# EAGLE board tracker (EAGLE 9.6.2), part 1 of 3
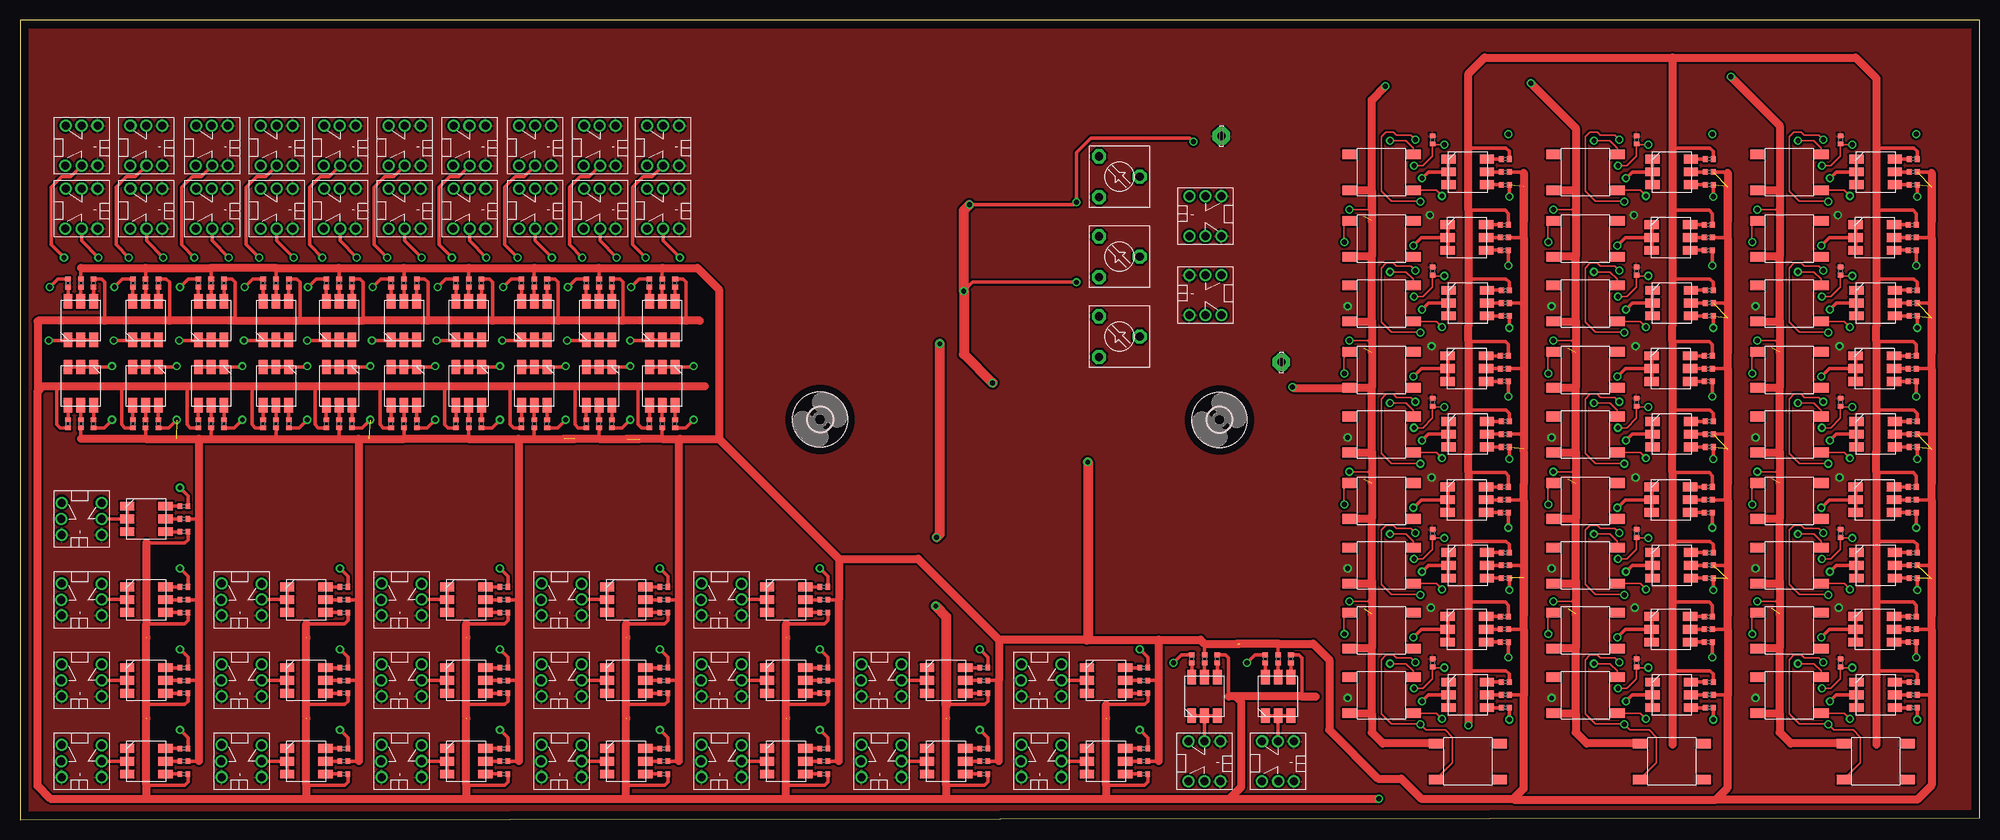
[diagram p6: board, top side]
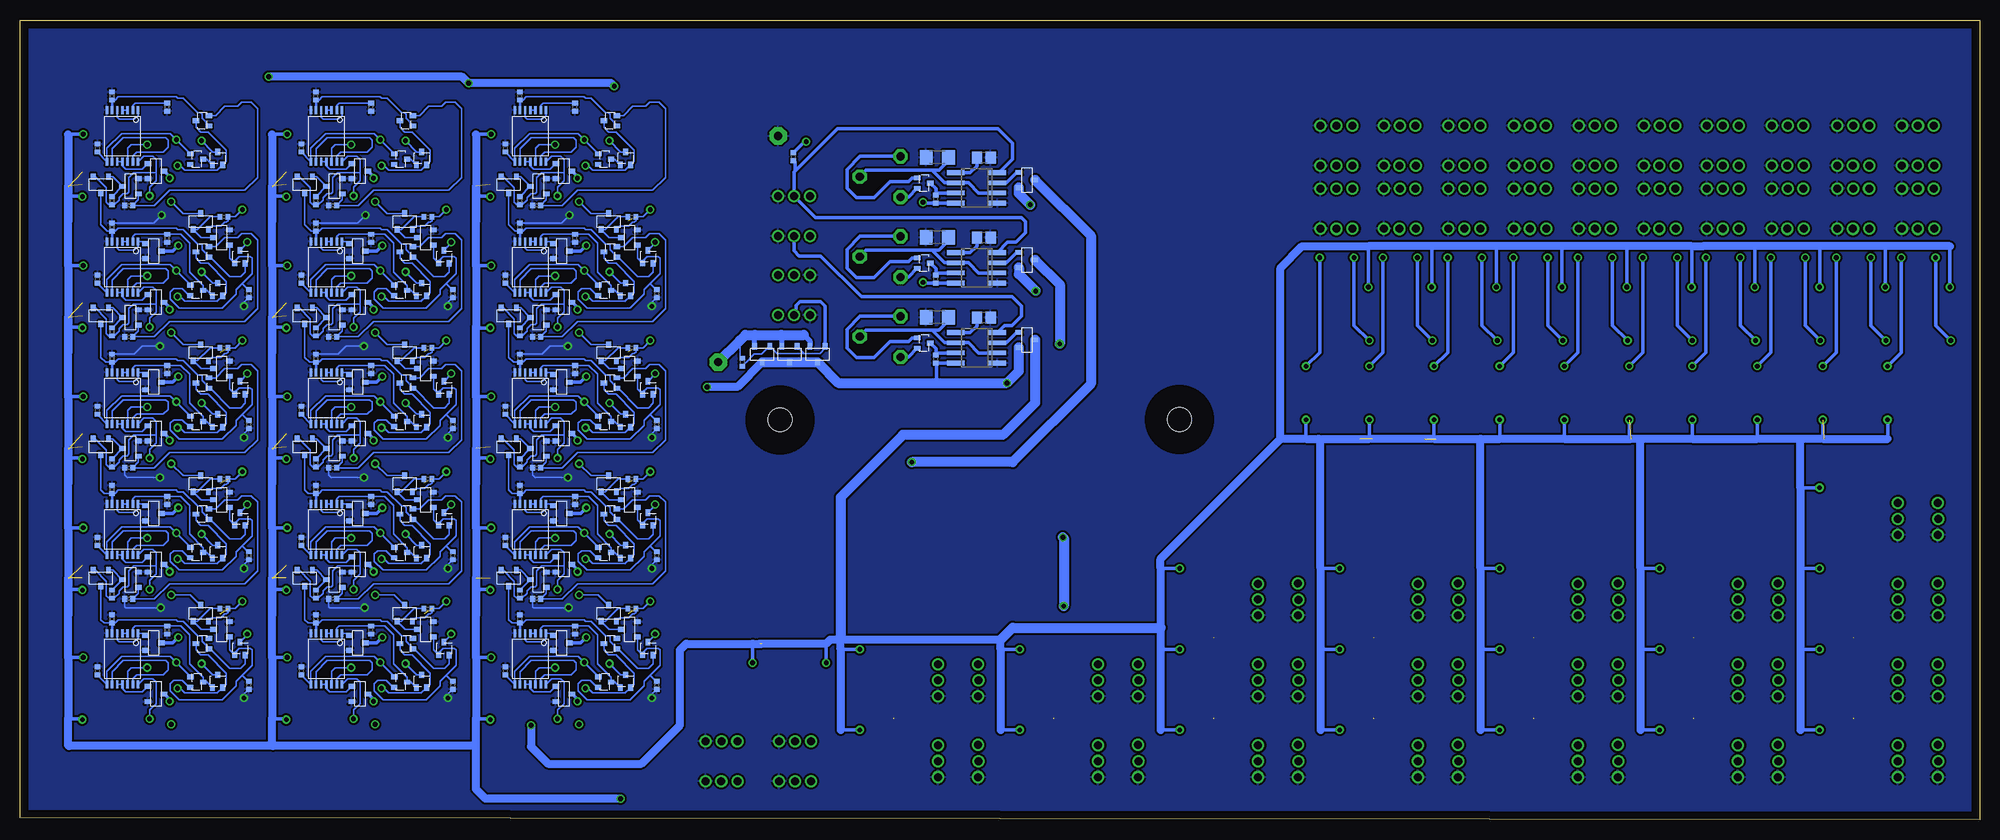
[diagram p7: board, bottom side, seen from below]

Size 245 x 100 mm. Coordinates in mm from the lower left corner, seen from the top.
Outline: 0,0 245,0.2 245,100 0,100 0,0
Copper layers (1*16): Top 0.035mm / dielectric 1.5mm / Bottom 0.035mm
Design rules "default": minimum track width 6mil, minimum drill 0.35mm, track to track 6mil, track to pad 6mil, pad to pad 6mil, via to via 6mil, smd to smd 6mil, copper to edge 40mil, drill to drill 6mil, minimum pad ring 10mil, minimum via ring 8mil, stop-mask expansion 4mil, vias tented up to drill 0mil, thermal gap 10mil

## Footprints (pad centres in the part's own frame; a part is rotated, then mirrored left to right if it is on the bottom)
LSP10 = drill 1.016 pad 2.159 octagon: MP 0,0
C2012 = smd 1.3 x 1.5: 1 -0.85,0; 2 0.85,0
C3216 = smd 1.6 x 1.8: 1 -1.4,0; 2 1.4,0
3,0 = hole 3: 0,0
SO08 = smd 0.6 x 2.2: 1 -1.905,-2.6; 2 -0.635,-2.6; 3 0.635,-2.6; 4 1.905,-2.6; 5 1.905,2.6; 6 0.635,2.6; 7 -0.635,2.6; 8 -1.905,2.6
R0402 = smd 0.6 x 0.7: 1 -0.5,0; 2 0.5,0
PT-10 = drill 1.016 pad 1.778 octagon: 1 -2.54,-5.08; 2 2.54,-5.08; 3 0,0
SOT23 = smd 0.6 x 0.8: SINGLE1 0,1.01; WIDEL -0.95,-1.01; WIDER 0.95,-1.01
TSSOP14 = smd 0.3 x 1: 1 -1.95,-3.2; 2 -1.3,-3.2; 3 -0.65,-3.2; 4 0,-3.2; 5 0.65,-3.2; 6 1.3,-3.2; 7 1.95,-3.2; 8 1.95,3.2; 9 1.3,3.2; 10 0.65,3.2; 11 0,3.2; 12 -0.65,3.2; 13 -1.3,3.2; 14 -1.95,3.2
SOT323 = smd 0.6 x 0.8: 1WIDEL -0.65,-0.8; 2WIDER 0.65,-0.816; 3SINGLE 0,0.8
SMD_MICROSWITCH = smd 1.8 x 1.2: 1 -4,2.25; 2 4,2.25; 3 -4,-2.25; 4 4,-2.25
BISTABLE_SWITCH = drill 1: A1 -1.991,2.498; A2 -0.013,2.521; A3 2.017,2.5; B1 -1.991,-2.5; B2 0.011,-2.5; B3 1.989,-2.492
SOT23@1 = smd 0.6 x 0.8: SINGLE1 0,1.01; WIDEL -0.95,-1.01; WIDER 0.95,-1.01
BIG_SMD_LED = smd 1.8 x 1.1: 1 -2.4,1.6; 2 -2.4,0; 3 -2.4,-1.6; 4 2.4,-1.6; 5 2.4,0; 6 2.4,1.6

## Placement (x,y rotation side)
BATERY-\  LSP10  [LSP10]  150.2,85.5 90 top
BATTERY+  LSP10  [LSP10]  157.7,57.2 90 top
C1  10n  [C2012]  124.5,82.8 0 bottom
C4  470p  [C3216]  130.3,82.8 180 bottom
C7  10n  [C2012]  124.5,72.8 0 bottom
C8  470p  [C3216]  130.3,72.8 180 bottom
C11  10n  [C2012]  124.5,62.8 0 bottom
C12  470p  [C3216]  130.3,62.8 180 bottom
H1  MOUNT-HOLE3.0  [3,0]  149.98,49.99 0 top
H2  MOUNT-HOLE3.0  [3,0]  100.05,50.05 0 top
IC2  NE555D  [SO08]  125.4,79 90 bottom
IC4  NE555D  [SO08]  125.4,69 90 bottom
IC6  NE555D  [SO08]  125.4,59 90 bottom
R1  1k5  [R0402]  211.1,23.8 180 top
R2  1k5  [R0402]  20.5,7.3 180 top
R3  1k  [R0402]  20.5,5.7 180 top
R4  1k  [R0402]  211.1,22.2 180 top
R5  1k  [R0402]  211.1,25.4 180 top
R6  1k5  [R0402]  211.2,15.6 180 top
R7  1k  [R0402]  211.2,14 180 top
R8  1k  [R0402]  211.2,17.2 180 top
R9  1k5  [R0402]  194,26.4 180 bottom
R10  1k5  [R0402]  202.1,19.6 90 top
R11  1k5  [R0402]  209.8,18.6 90 bottom
R12  1k5  [R0402]  208,25.1 90 bottom
R13  1k5  [R0402]  201.1,23.7 270 bottom
R14  1k5  [R0402]  190.9,16.8 90 bottom
R15  1k5  [R0402]  154.7,57.2 90 bottom
R16  1k5  [R0402]  148.3,82.9 90 bottom
R21  1k  [R0402]  20.5,8.9 180 top
R28  1k5  [R0402]  20.5,17.4 180 top
R29  1k  [R0402]  20.5,15.8 180 top
R30  1k  [R0402]  20.5,19 180 top
R31  1k5  [R0402]  20.5,27.5 180 top
R32  1k  [R0402]  20.5,25.9 180 top
R33  1k  [R0402]  20.5,29.1 180 top
R34  1k5  [R0402]  20.5,37.6 180 top
R35  1k  [R0402]  20.5,36 180 top
R36  1k  [R0402]  20.5,39.2 180 top
R37  1k5  [R0402]  211.1,40 180 top
R38  1k  [R0402]  211.1,38.4 180 top
R39  1k  [R0402]  211.1,41.6 180 top
R40  1k5  [R0402]  211.2,31.8 180 top
R41  1k  [R0402]  211.2,30.2 180 top
R42  1k  [R0402]  211.2,33.4 180 top
R57  1k5  [R0402]  208,28.2 90 bottom
R58  1k5  [R0402]  194,42.6 180 bottom
R59  1k5  [R0402]  202.1,35.8 90 top
R60  1k5  [R0402]  40.5,7.3 180 top
R61  1k  [R0402]  40.5,5.7 180 top
R62  1k  [R0402]  40.5,8.9 180 top
R63  1k5  [R0402]  40.5,17.4 180 top
R64  1k  [R0402]  40.5,15.8 180 top
R65  1k  [R0402]  40.5,19 180 top
R66  1k5  [R0402]  40.5,27.5 180 top
R67  1k  [R0402]  40.5,25.9 180 top
R68  1k  [R0402]  40.5,29.1 180 top
R69  1k5  [R0402]  209.8,34.8 90 bottom
R70  1k5  [R0402]  208,41.3 90 bottom
R85  1k5  [R0402]  201.1,39.9 270 bottom
R86  1k5  [R0402]  190.9,33 90 bottom
R87  1k5  [R0402]  205.9,27.6 0 bottom
R88  1k5  [R0402]  211.1,56.4 180 top
R89  1k  [R0402]  211.1,54.8 180 top
R90  1k  [R0402]  211.1,58 180 top
R91  1k5  [R0402]  211.2,48.2 180 top
R92  1k5  [R0402]  60.5,7.3 180 top
R93  1k  [R0402]  60.5,5.7 180 top
R94  1k  [R0402]  60.5,8.9 180 top
R95  1k5  [R0402]  60.5,17.4 180 top
R96  1k  [R0402]  60.5,15.8 180 top
R97  1k  [R0402]  60.5,19 180 top
R98  1k5  [R0402]  60.5,27.5 180 top
R113  1k  [R0402]  60.5,25.9 180 top
R114  1k  [R0402]  60.5,29.1 180 top
R115  1k  [R0402]  211.2,46.6 180 top
R116  1k  [R0402]  211.2,49.8 180 top
R117  1k5  [R0402]  208,44.6 90 bottom
R118  1k5  [R0402]  194,59 180 bottom
R119  1k5  [R0402]  202.1,52.2 90 top
R120  1k5  [R0402]  209.8,51.2 90 bottom
R121  1k5  [R0402]  208,57.7 90 bottom
R122  1k5  [R0402]  201.1,56.3 270 bottom
R123  1k5  [R0402]  190.9,49.4 90 bottom
R124  1k5  [R0402]  80.5,7.3 180 top
R125  1k  [R0402]  80.5,5.7 180 top
R126  1k  [R0402]  80.5,8.9 180 top
R127  1k5  [R0402]  80.5,17.4 180 top
R128  1k  [R0402]  80.5,15.8 180 top
R129  1k  [R0402]  80.5,19 180 top
R134  1k5  [R0402]  80.5,27.5 180 top
R137  1k5  [R0402]  7.6,49.5 90 top
R138  1k  [R0402]  6,49.5 90 top
R139  1k  [R0402]  80.5,25.9 180 top
R140  1k  [R0402]  9.2,49.5 90 top
R141  1k  [R0402]  80.5,29.1 180 top
R142  1k5  [R0402]  205.9,44 0 bottom
R143  1k5  [R0402]  211.1,72.8 180 top
R144  1k  [R0402]  211.1,71.2 180 top
R145  1k  [R0402]  211.1,74.4 180 top
R146  1k5  [R0402]  211.2,64.6 180 top
R147  1k  [R0402]  211.2,63 180 top
R148  1k  [R0402]  211.2,66.2 180 top
R149  1k5  [R0402]  208,61 90 bottom
R150  1k5  [R0402]  194,75.4 180 bottom
R151  1k5  [R0402]  100.5,7.3 180 top
R152  1k  [R0402]  100.5,5.7 180 top
R153  1k  [R0402]  100.5,8.9 180 top
R154  1k5  [R0402]  100.5,17.4 180 top
R155  1k  [R0402]  100.5,15.8 180 top
R156  1k  [R0402]  100.5,19 180 top
R157  1k5  [R0402]  100.5,27.5 180 top
R158  1k  [R0402]  100.5,25.9 180 top
R159  1k  [R0402]  100.5,29.1 180 top
R160  1k5  [R0402]  202.1,68.6 90 top
R161  1k5  [R0402]  209.8,67.6 90 bottom
R162  1k5  [R0402]  208,74.1 90 bottom
R163  1k5  [R0402]  201.1,72.7 270 bottom
R164  1k5  [R0402]  190.9,65.8 90 bottom
R165  1k5  [R0402]  205.9,60.4 0 bottom
R166  1k5  [R0402]  120.5,7.3 180 top
R167  1k  [R0402]  120.5,5.7 180 top
R168  1k  [R0402]  120.5,8.9 180 top
R169  1k5  [R0402]  120.5,17.4 180 top
R170  1k  [R0402]  120.5,15.8 180 top
R171  1k  [R0402]  120.5,19 180 top
R172  1k5  [R0402]  211.2,81 180 top
R173  1k  [R0402]  211.2,79.4 180 top
R174  1k  [R0402]  211.2,82.6 180 top
R175  1k5  [R0402]  208,77.4 90 bottom
R176  1k5  [R0402]  202.1,85 90 top
R177  1k5  [R0402]  209.8,84 90 bottom
R178  1k5  [R0402]  140.5,7.3 180 top
R179  1k  [R0402]  140.5,5.7 180 top
R180  1k  [R0402]  140.5,8.9 180 top
R181  1k5  [R0402]  140.5,17.4 180 top
R182  1k  [R0402]  140.5,15.8 180 top
R183  1k  [R0402]  140.5,19 180 top
R184  1k5  [R0402]  185.6,23.8 180 top
R185  1k  [R0402]  185.6,22.2 180 top
R186  1k  [R0402]  185.6,25.4 180 top
R187  1k5  [R0402]  148.1,20.1 270 top
R188  1k  [R0402]  149.7,20.1 270 top
R189  1k  [R0402]  146.5,20.1 270 top
R190  1k5  [R0402]  185.7,15.6 180 top
R191  1k  [R0402]  185.7,14 180 top
R192  1k  [R0402]  185.7,17.2 180 top
R193  1k5  [R0402]  157.3,20.1 270 top
R194  1k  [R0402]  158.9,20.1 270 top
R195  1k  [R0402]  155.7,20.1 270 top
R196  1k5  [R0402]  168.5,26.4 180 bottom
R197  1k5  [R0402]  176.6,19.6 90 top
R198  1k5  [R0402]  184.3,18.6 90 bottom
R199  1k5  [R0402]  182.5,25.1 90 bottom
R200  1k5  [R0402]  175.6,23.7 270 bottom
R201  1k5  [R0402]  165.4,16.8 90 bottom
R202  1k5  [R0402]  185.6,40 180 top
R203  1k  [R0402]  185.6,38.4 180 top
R204  1k  [R0402]  185.6,41.6 180 top
R205  1k5  [R0402]  185.7,31.8 180 top
R206  1k  [R0402]  185.7,30.2 180 top
R207  1k  [R0402]  185.7,33.4 180 top
R208  1k5  [R0402]  182.5,28.2 90 bottom
R209  1k5  [R0402]  168.5,42.6 180 bottom
R210  1k5  [R0402]  176.6,35.8 90 top
R211  1k5  [R0402]  184.3,34.8 90 bottom
R212  1k5  [R0402]  182.5,41.3 90 bottom
R213  1k5  [R0402]  175.6,39.9 270 bottom
R214  1k5  [R0402]  165.4,33 90 bottom
R215  1k5  [R0402]  180.4,27.6 0 bottom
R216  1k5  [R0402]  185.6,56.4 180 top
R217  1k  [R0402]  185.6,54.8 180 top
R218  1k  [R0402]  185.6,58 180 top
R219  1k5  [R0402]  185.7,48.2 180 top
R220  1k  [R0402]  185.7,46.6 180 top
R221  1k  [R0402]  185.7,49.8 180 top
R222  1k5  [R0402]  182.5,44.6 90 bottom
R223  1k5  [R0402]  168.5,59 180 bottom
R224  1k5  [R0402]  176.6,52.2 90 top
R225  1k5  [R0402]  184.3,51.2 90 bottom
R226  1k5  [R0402]  182.5,57.7 90 bottom
R227  1k5  [R0402]  175.6,56.3 270 bottom
R228  1k5  [R0402]  165.4,49.4 90 bottom
R229  1k5  [R0402]  180.4,44 0 bottom
R230  1k5  [R0402]  185.6,72.8 180 top
R231  1k  [R0402]  185.6,71.2 180 top
R232  1k  [R0402]  185.6,74.4 180 top
R233  1k5  [R0402]  185.7,64.6 180 top
R234  1k  [R0402]  185.7,63 180 top
R235  1k  [R0402]  185.7,66.2 180 top
R236  1k5  [R0402]  182.5,61 90 bottom
R237  1k5  [R0402]  168.5,75.4 180 bottom
R238  1k5  [R0402]  176.6,68.6 90 top
R239  1k5  [R0402]  184.3,67.6 90 bottom
R240  1k5  [R0402]  182.5,74.1 90 bottom
R241  1k5  [R0402]  175.6,72.7 270 bottom
R242  1k5  [R0402]  165.4,65.8 90 bottom
R243  1k5  [R0402]  180.4,60.4 0 bottom
R244  1k5  [R0402]  185.7,81 180 top
R245  1k  [R0402]  185.7,79.4 180 top
R246  1k  [R0402]  185.7,82.6 180 top
R247  1k5  [R0402]  182.5,77.4 90 bottom
R248  1k5  [R0402]  176.6,85 90 top
R249  1k5  [R0402]  184.3,84 90 bottom
R250  1k5  [R0402]  182.5,90.5 90 bottom
R251  1k5  [R0402]  175.6,89.1 270 bottom
R252  1k5  [R0402]  180.4,76.8 0 bottom
R253  1k5  [R0402]  208,90.5 90 bottom
R254  1k5  [R0402]  201.1,89.1 270 bottom
R255  1k5  [R0402]  205.9,76.8 0 bottom
R256  1k5  [R0402]  236.6,23.8 180 top
R257  1k  [R0402]  236.6,22.2 180 top
R258  1k  [R0402]  236.6,25.4 180 top
R259  1k5  [R0402]  236.7,15.6 180 top
R260  1k  [R0402]  236.7,14 180 top
R261  1k  [R0402]  236.7,17.2 180 top
R262  1k5  [R0402]  219.5,26.4 180 bottom
R263  1k5  [R0402]  227.6,19.6 90 top
R264  1k5  [R0402]  235.3,18.6 90 bottom
R265  1k5  [R0402]  233.5,25.1 90 bottom
R266  1k5  [R0402]  226.6,23.7 270 bottom
R267  1k5  [R0402]  216.4,16.8 90 bottom
R268  1k5  [R0402]  236.6,40 180 top
R269  1k  [R0402]  236.6,38.4 180 top
R270  1k  [R0402]  236.6,41.6 180 top
R271  1k5  [R0402]  236.7,31.8 180 top
R272  1k  [R0402]  236.7,30.2 180 top
R273  1k  [R0402]  236.7,33.4 180 top
R274  1k5  [R0402]  233.5,28.2 90 bottom
R275  1k5  [R0402]  219.5,42.6 180 bottom
R276  1k5  [R0402]  227.6,35.8 90 top
R277  1k5  [R0402]  235.3,34.8 90 bottom
R278  1k5  [R0402]  233.5,41.3 90 bottom
R279  1k5  [R0402]  226.6,39.9 270 bottom
R280  1k5  [R0402]  216.4,33 90 bottom
R281  1k5  [R0402]  231.4,27.6 0 bottom
R282  1k5  [R0402]  236.6,56.4 180 top
R283  1k  [R0402]  236.6,54.8 180 top
R284  1k  [R0402]  236.6,58 180 top
R285  1k5  [R0402]  236.7,48.2 180 top
R286  1k  [R0402]  236.7,46.6 180 top
R287  1k  [R0402]  236.7,49.8 180 top
R288  1k5  [R0402]  233.5,44.6 90 bottom
R289  1k5  [R0402]  219.5,59 180 bottom
R290  1k5  [R0402]  227.6,52.2 90 top
R291  1k5  [R0402]  235.3,51.2 90 bottom
R292  1k5  [R0402]  233.5,57.7 90 bottom
R293  1k5  [R0402]  226.6,56.3 270 bottom
R294  1k5  [R0402]  216.4,49.4 90 bottom
R295  1k5  [R0402]  231.4,44 0 bottom
R296  1k5  [R0402]  236.6,72.8 180 top
R297  1k  [R0402]  236.6,71.2 180 top
R298  1k  [R0402]  236.6,74.4 180 top
R299  1k5  [R0402]  236.7,64.6 180 top
R300  1k  [R0402]  236.7,63 180 top
R301  1k  [R0402]  236.7,66.2 180 top
R302  1k5  [R0402]  233.5,61 90 bottom
R303  1k5  [R0402]  219.5,75.4 180 bottom
R304  1k5  [R0402]  227.6,68.6 90 top
R305  1k5  [R0402]  235.3,67.6 90 bottom
R306  1k5  [R0402]  233.5,74.1 90 bottom
R307  1k5  [R0402]  226.6,72.7 270 bottom
R308  1k5  [R0402]  216.4,65.8 90 bottom
R309  1k5  [R0402]  231.4,60.4 0 bottom
R310  1k5  [R0402]  236.7,81 180 top
R311  1k  [R0402]  236.7,79.4 180 top
R312  1k  [R0402]  236.7,82.6 180 top
R313  1k5  [R0402]  233.5,77.4 90 bottom
R314  1k5  [R0402]  227.6,85 90 top
R315  1k5  [R0402]  235.3,84 90 bottom
R316  1k5  [R0402]  233.5,90.5 90 bottom
R317  1k5  [R0402]  226.6,89.1 270 bottom
R318  1k5  [R0402]  231.4,76.8 0 bottom
R319  1k5  [R0402]  7.6,67.1 270 top
R320  1k  [R0402]  9.2,67.1 270 top
R321  1k  [R0402]  6,67.1 270 top
R322  1k5  [R0402]  15.7,49.5 90 top
R323  1k  [R0402]  14.1,49.5 90 top
R324  1k  [R0402]  17.3,49.5 90 top
R325  1k5  [R0402]  15.7,67.1 270 top
R326  1k  [R0402]  17.3,67.1 270 top
R327  1k  [R0402]  14.1,67.1 270 top
R328  1k5  [R0402]  23.9,49.5 90 top
R329  1k  [R0402]  22.3,49.5 90 top
R330  1k  [R0402]  25.5,49.5 90 top
R331  1k5  [R0402]  23.9,67.1 270 top
R332  1k  [R0402]  25.5,67.1 270 top
R333  1k  [R0402]  22.3,67.1 270 top
R334  1k5  [R0402]  32,49.5 90 top
R335  1k  [R0402]  30.4,49.5 90 top
R336  1k  [R0402]  33.6,49.5 90 top
R337  1k5  [R0402]  32,67.1 270 top
R338  1k  [R0402]  33.6,67.1 270 top
R339  1k  [R0402]  30.4,67.1 270 top
R340  1k5  [R0402]  39.9,49.5 90 top
R341  1k  [R0402]  38.3,49.5 90 top
R342  1k  [R0402]  41.5,49.5 90 top
R343  1k5  [R0402]  39.9,67.1 270 top
R344  1k  [R0402]  41.5,67.1 270 top
R345  1k  [R0402]  38.3,67.1 270 top
R346  1k5  [R0402]  48,49.5 90 top
R347  1k  [R0402]  46.4,49.5 90 top
R348  1k  [R0402]  49.6,49.5 90 top
R349  1k5  [R0402]  48,67.1 270 top
R350  1k  [R0402]  49.6,67.1 270 top
R351  1k  [R0402]  46.4,67.1 270 top
R352  1k5  [R0402]  56.1,49.5 90 top
R353  1k  [R0402]  54.5,49.5 90 top
R354  1k  [R0402]  57.7,49.5 90 top
R355  1k5  [R0402]  56.1,67.1 270 top
R356  1k  [R0402]  57.7,67.1 270 top
R357  1k  [R0402]  54.5,67.1 270 top
R358  1k5  [R0402]  64.3,49.5 90 top
R359  1k  [R0402]  62.7,49.5 90 top
R360  1k  [R0402]  65.9,49.5 90 top
R361  1k5  [R0402]  64.3,67.1 270 top
R362  1k  [R0402]  65.9,67.1 270 top
R363  1k  [R0402]  62.7,67.1 270 top
R364  1k5  [R0402]  72.4,49.5 90 top
R365  1k  [R0402]  70.8,49.5 90 top
R366  1k  [R0402]  74,49.5 90 top
R367  1k5  [R0402]  72.4,67.1 270 top
R368  1k  [R0402]  74,67.1 270 top
R369  1k  [R0402]  70.8,67.1 270 top
R370  1k5  [R0402]  80.3,49.5 90 top
R371  1k  [R0402]  78.7,49.5 90 top
R372  1k  [R0402]  81.9,49.5 90 top
R373  1k5  [R0402]  80.3,67.1 270 top
R374  1k  [R0402]  81.9,67.1 270 top
R375  1k  [R0402]  78.7,67.1 270 top
R378  [PT-10]  140,80.4 270 top
R379  1k  [R0402]  130.5,77.6 270 bottom
R382  [PT-10]  140,70.4 270 top
R383  1k  [R0402]  130.5,67.6 270 bottom
R386  [PT-10]  140,60.4 270 top
R387  1k  [R0402]  130.5,57.6 270 bottom
U$1  YJL2301D_PMOSFET  [SOT23]  145.3,58.2 180 bottom
U$2  YJL2301D_PMOSFET  [SOT23]  148.8,58.2 180 bottom
U$3  YJL2301D_PMOSFET  [SOT23]  152.2,58.2 180 bottom
U$4  74HC02PW_QUAD_NOR  [TSSOP14]  206.7,20.1 180 bottom
U$5  BAT54SW_SERIES_DIODES  [SOT323]  197.4,17.2 270 bottom
U$6  BAT54SW_SERIES_DIODES  [SOT323]  196.7,22 90 bottom
U$7  SMD_MOCROSWITCH  [SMD_MICROSWITCH]  195.73,23.64 180 top
U$8  SMD_MOCROSWITCH  [SMD_MICROSWITCH]  195.73,15.55 180 top
U$9  BAT5406W_COMON_CATHODE_DIODES  [SOT323]  192,21.4 0 bottom
U$10  BAT5406W_COMON_CATHODE_DIODES  [SOT323]  194.8,17.3 0 bottom
U$11  BISTABLESWITCH  [BISTABLE_SWITCH]  148.22,65.57 0 top
U$12  BISTABLESWITCH  [BISTABLE_SWITCH]  148.22,75.47 0 top
U$20  YJL2304A_NMOSFET  [SOT23@1]  202.8,22.1 270 bottom
U$22  BISTABLESWITCH  [BISTABLE_SWITCH]  7.7,7.3 90 top
U$24  TC5050RGB_LED  [BIG_SMD_LED]  15.8,7.3 180 top
U$25  BISTABLESWITCH  [BISTABLE_SWITCH]  7.7,17.4 90 top
U$26  TC5050RGB_LED  [BIG_SMD_LED]  15.8,17.4 180 top
U$27  BISTABLESWITCH  [BISTABLE_SWITCH]  7.7,27.5 90 top
U$28  TC5050RGB_LED  [BIG_SMD_LED]  15.8,27.5 180 top
U$29  BISTABLESWITCH  [BISTABLE_SWITCH]  7.7,37.6 90 top
U$30  TC5050RGB_LED  [BIG_SMD_LED]  15.8,37.6 180 top
U$31  YJL2304A_NMOSFET  [SOT23@1]  202.5,15.7 270 bottom
U$32  TC5050RGB_LED  [BIG_SMD_LED]  206.4,23.8 180 top
U$33  TC5050RGB_LED  [BIG_SMD_LED]  206.5,15.6 180 top
U$34  YJL2304A_NMOSFET  [SOT23@1]  196.9,25.8 0 bottom
U$35  YJL2301D_PMOSFET  [SOT23]  194.3,23.8 90 bottom
U$36  74HC02PW_QUAD_NOR  [TSSOP14]  206.7,36.3 180 bottom
U$37  BISTABLESWITCH  [BISTABLE_SWITCH]  27.7,7.3 90 top
U$38  TC5050RGB_LED  [BIG_SMD_LED]  35.8,7.3 180 top
U$39  BISTABLESWITCH  [BISTABLE_SWITCH]  27.7,17.4 90 top
U$40  TC5050RGB_LED  [BIG_SMD_LED]  35.8,17.4 180 top
U$43  BISTABLESWITCH  [BISTABLE_SWITCH]  27.7,27.5 90 top
U$44  TC5050RGB_LED  [BIG_SMD_LED]  35.8,27.5 180 top
U$57  BAT54SW_SERIES_DIODES  [SOT323]  197.4,33.4 270 bottom
U$59  BAT54SW_SERIES_DIODES  [SOT323]  196.7,38.2 90 bottom
U$60  SMD_MOCROSWITCH  [SMD_MICROSWITCH]  195.73,39.84 180 top
U$61  SMD_MOCROSWITCH  [SMD_MICROSWITCH]  195.73,31.75 180 top
U$62  BAT5406W_COMON_CATHODE_DIODES  [SOT323]  192,37.6 0 bottom
U$63  BAT5406W_COMON_CATHODE_DIODES  [SOT323]  194.8,33.5 0 bottom
U$64  BISTABLESWITCH  [BISTABLE_SWITCH]  47.7,7.3 90 top
U$65  TC5050RGB_LED  [BIG_SMD_LED]  55.8,7.3 180 top
U$66  BISTABLESWITCH  [BISTABLE_SWITCH]  47.7,17.4 90 top
U$67  TC5050RGB_LED  [BIG_SMD_LED]  55.8,17.4 180 top
U$68  BISTABLESWITCH  [BISTABLE_SWITCH]  47.7,27.5 90 top
U$69  TC5050RGB_LED  [BIG_SMD_LED]  55.8,27.5 180 top
U$70  YJL2304A_NMOSFET  [SOT23@1]  202.8,38.3 270 bottom
U$71  YJL2304A_NMOSFET  [SOT23@1]  202.5,31.9 270 bottom
U$72  TC5050RGB_LED  [BIG_SMD_LED]  206.4,40 180 top
U$73  TC5050RGB_LED  [BIG_SMD_LED]  206.5,31.8 180 top
U$74  YJL2304A_NMOSFET  [SOT23@1]  205.7,30 90 bottom
U$75  YJL2304A_NMOSFET  [SOT23@1]  196.9,42 0 bottom
U$87  BISTABLESWITCH  [BISTABLE_SWITCH]  7.7,76.4 180 top
U$88  TC5050RGB_LED  [BIG_SMD_LED]  7.6,54.2 90 top
U$89  BISTABLESWITCH  [BISTABLE_SWITCH]  7.7,84.3 180 top
U$90  TC5050RGB_LED  [BIG_SMD_LED]  7.6,62.4 270 top
U$91  BISTABLESWITCH  [BISTABLE_SWITCH]  67.7,7.3 90 top
U$92  TC5050RGB_LED  [BIG_SMD_LED]  75.8,7.3 180 top
U$93  BISTABLESWITCH  [BISTABLE_SWITCH]  67.7,17.4 90 top
U$94  TC5050RGB_LED  [BIG_SMD_LED]  75.8,17.4 180 top
U$95  BISTABLESWITCH  [BISTABLE_SWITCH]  67.7,27.5 90 top
U$96  TC5050RGB_LED  [BIG_SMD_LED]  75.8,27.5 180 top
U$97  YJL2301D_PMOSFET  [SOT23]  209.4,30.2 180 bottom
U$98  YJL2301D_PMOSFET  [SOT23]  194.3,40 90 bottom
U$99  74HC02PW_QUAD_NOR  [TSSOP14]  206.7,52.7 180 bottom
U$100  BAT54SW_SERIES_DIODES  [SOT323]  197.4,49.8 270 bottom
U$101  BAT54SW_SERIES_DIODES  [SOT323]  196.7,54.6 90 bottom
U$102  SMD_MOCROSWITCH  [SMD_MICROSWITCH]  195.73,56.24 180 top
U$103  BISTABLESWITCH  [BISTABLE_SWITCH]  87.7,7.3 90 top
U$104  TC5050RGB_LED  [BIG_SMD_LED]  95.8,7.3 180 top
U$105  BISTABLESWITCH  [BISTABLE_SWITCH]  87.7,17.4 90 top
U$106  BISTABLESWITCH  [BISTABLE_SWITCH]  15.8,76.4 180 top
U$107  TC5050RGB_LED  [BIG_SMD_LED]  15.7,54.2 90 top
U$108  BISTABLESWITCH  [BISTABLE_SWITCH]  15.8,84.3 180 top
U$109  TC5050RGB_LED  [BIG_SMD_LED]  15.7,62.4 270 top
U$110  BISTABLESWITCH  [BISTABLE_SWITCH]  24,76.4 180 top
U$111  TC5050RGB_LED  [BIG_SMD_LED]  23.9,54.2 90 top
U$112  BISTABLESWITCH  [BISTABLE_SWITCH]  24,84.3 180 top
U$113  TC5050RGB_LED  [BIG_SMD_LED]  23.9,62.4 270 top
U$114  BISTABLESWITCH  [BISTABLE_SWITCH]  32.1,76.4 180 top
U$115  TC5050RGB_LED  [BIG_SMD_LED]  32,54.2 90 top
U$116  BISTABLESWITCH  [BISTABLE_SWITCH]  32.1,84.3 180 top
U$117  TC5050RGB_LED  [BIG_SMD_LED]  32,62.4 270 top
U$118  BISTABLESWITCH  [BISTABLE_SWITCH]  40,76.4 180 top
U$119  TC5050RGB_LED  [BIG_SMD_LED]  39.9,54.2 90 top
U$120  BISTABLESWITCH  [BISTABLE_SWITCH]  40,84.3 180 top
U$121  TC5050RGB_LED  [BIG_SMD_LED]  95.8,17.4 180 top
U$122  BISTABLESWITCH  [BISTABLE_SWITCH]  87.7,27.5 90 top
U$123  TC5050RGB_LED  [BIG_SMD_LED]  95.8,27.5 180 top
U$124  SMD_MOCROSWITCH  [SMD_MICROSWITCH]  195.73,48.15 180 top
U$125  BAT5406W_COMON_CATHODE_DIODES  [SOT323]  192,54 0 bottom
U$126  BAT5406W_COMON_CATHODE_DIODES  [SOT323]  194.8,49.9 0 bottom
U$127  YJL2304A_NMOSFET  [SOT23@1]  202.8,54.7 270 bottom
U$128  BISTABLESWITCH  [BISTABLE_SWITCH]  107.7,7.3 90 top
U$129  TC5050RGB_LED  [BIG_SMD_LED]  115.8,7.3 180 top
U$130  BISTABLESWITCH  [BISTABLE_SWITCH]  107.7,17.4 90 top
U$131  TC5050RGB_LED  [BIG_SMD_LED]  115.8,17.4 180 top
U$132  YJL2304A_NMOSFET  [SOT23@1]  202.5,48.3 270 bottom
U$133  TC5050RGB_LED  [BIG_SMD_LED]  206.4,56.4 180 top
U$134  TC5050RGB_LED  [BIG_SMD_LED]  206.5,48.2 180 top
U$135  YJL2304A_NMOSFET  [SOT23@1]  205.7,46.4 90 bottom
U$136  TC5050RGB_LED  [BIG_SMD_LED]  39.9,62.4 270 top
U$137  BISTABLESWITCH  [BISTABLE_SWITCH]  48.1,76.4 180 top
U$138  TC5050RGB_LED  [BIG_SMD_LED]  48,54.2 90 top
U$139  BISTABLESWITCH  [BISTABLE_SWITCH]  127.7,7.3 90 top
U$140  BISTABLESWITCH  [BISTABLE_SWITCH]  48.1,84.3 180 top
U$141  TC5050RGB_LED  [BIG_SMD_LED]  135.8,7.3 180 top
U$142  TC5050RGB_LED  [BIG_SMD_LED]  48,62.4 270 top
U$143  BISTABLESWITCH  [BISTABLE_SWITCH]  127.7,17.4 90 top
U$144  BISTABLESWITCH  [BISTABLE_SWITCH]  56.2,76.4 180 top
U$145  TC5050RGB_LED  [BIG_SMD_LED]  135.8,17.4 180 top
U$146  TC5050RGB_LED  [BIG_SMD_LED]  56.1,54.2 90 top
U$147  BISTABLESWITCH  [BISTABLE_SWITCH]  56.2,84.3 180 top
U$148  74HC02PW_QUAD_NOR  [TSSOP14]  181.2,20.1 180 bottom
U$149  TC5050RGB_LED  [BIG_SMD_LED]  56.1,62.4 270 top
U$150  BAT54SW_SERIES_DIODES  [SOT323]  171.9,17.2 270 bottom
U$151  BISTABLESWITCH  [BISTABLE_SWITCH]  148.1,7.3 180 top
U$152  TC5050RGB_LED  [BIG_SMD_LED]  148.1,15.4 270 top
U$153  BAT54SW_SERIES_DIODES  [SOT323]  171.2,22 90 bottom
U$154  SMD_MOCROSWITCH  [SMD_MICROSWITCH]  170.23,23.64 180 top
U$155  BISTABLESWITCH  [BISTABLE_SWITCH]  157.3,7.3 180 top
U$156  TC5050RGB_LED  [BIG_SMD_LED]  157.3,15.4 270 top
U$157  SMD_MOCROSWITCH  [SMD_MICROSWITCH]  170.23,15.55 180 top
U$158  BAT5406W_COMON_CATHODE_DIODES  [SOT323]  166.5,21.4 0 bottom
U$159  BAT5406W_COMON_CATHODE_DIODES  [SOT323]  169.3,17.3 0 bottom
U$160  YJL2304A_NMOSFET  [SOT23@1]  177.3,22.1 270 bottom
U$161  YJL2304A_NMOSFET  [SOT23@1]  177,15.7 270 bottom
U$162  TC5050RGB_LED  [BIG_SMD_LED]  180.9,23.8 180 top
U$163  TC5050RGB_LED  [BIG_SMD_LED]  181,15.6 180 top
U$164  YJL2304A_NMOSFET  [SOT23@1]  171.4,25.8 0 bottom
U$165  YJL2301D_PMOSFET  [SOT23]  168.8,23.8 90 bottom
U$166  74HC02PW_QUAD_NOR  [TSSOP14]  181.2,36.3 180 bottom
U$167  BAT54SW_SERIES_DIODES  [SOT323]  171.9,33.4 270 bottom
U$168  BAT54SW_SERIES_DIODES  [SOT323]  171.2,38.2 90 bottom
U$169  SMD_MOCROSWITCH  [SMD_MICROSWITCH]  170.23,39.84 180 top
U$170  SMD_MOCROSWITCH  [SMD_MICROSWITCH]  170.23,31.75 180 top
U$171  BAT5406W_COMON_CATHODE_DIODES  [SOT323]  166.5,37.6 0 bottom
U$172  BAT5406W_COMON_CATHODE_DIODES  [SOT323]  169.3,33.5 0 bottom
U$173  YJL2304A_NMOSFET  [SOT23@1]  177.3,38.3 270 bottom
U$174  YJL2304A_NMOSFET  [SOT23@1]  177,31.9 270 bottom
U$175  TC5050RGB_LED  [BIG_SMD_LED]  180.9,40 180 top
U$176  TC5050RGB_LED  [BIG_SMD_LED]  181,31.8 180 top
U$177  YJL2304A_NMOSFET  [SOT23@1]  180.2,30 90 bottom
U$178  YJL2304A_NMOSFET  [SOT23@1]  171.4,42 0 bottom
U$179  YJL2301D_PMOSFET  [SOT23]  183.9,30.2 180 bottom
U$180  YJL2301D_PMOSFET  [SOT23]  168.8,40 90 bottom
U$181  74HC02PW_QUAD_NOR  [TSSOP14]  181.2,52.7 180 bottom
U$182  BAT54SW_SERIES_DIODES  [SOT323]  171.9,49.8 270 bottom
U$183  BAT54SW_SERIES_DIODES  [SOT323]  171.2,54.6 90 bottom
U$184  SMD_MOCROSWITCH  [SMD_MICROSWITCH]  170.23,56.24 180 top
U$185  SMD_MOCROSWITCH  [SMD_MICROSWITCH]  170.23,48.15 180 top
U$186  BAT5406W_COMON_CATHODE_DIODES  [SOT323]  166.5,54 0 bottom
U$187  BAT5406W_COMON_CATHODE_DIODES  [SOT323]  169.3,49.9 0 bottom
U$188  YJL2304A_NMOSFET  [SOT23@1]  177.3,54.7 270 bottom
U$189  YJL2304A_NMOSFET  [SOT23@1]  177,48.3 270 bottom
U$190  TC5050RGB_LED  [BIG_SMD_LED]  180.9,56.4 180 top
U$191  TC5050RGB_LED  [BIG_SMD_LED]  181,48.2 180 top
U$192  YJL2304A_NMOSFET  [SOT23@1]  180.2,46.4 90 bottom
U$193  YJL2304A_NMOSFET  [SOT23@1]  171.4,58.4 0 bottom
U$194  YJL2301D_PMOSFET  [SOT23]  183.9,46.6 180 bottom
U$195  YJL2301D_PMOSFET  [SOT23]  168.8,56.4 90 bottom
U$196  74HC02PW_QUAD_NOR  [TSSOP14]  181.2,69.1 180 bottom
U$197  BAT54SW_SERIES_DIODES  [SOT323]  171.9,66.2 270 bottom
U$198  BAT54SW_SERIES_DIODES  [SOT323]  171.2,71 90 bottom
U$199  SMD_MOCROSWITCH  [SMD_MICROSWITCH]  170.23,72.64 180 top
U$200  SMD_MOCROSWITCH  [SMD_MICROSWITCH]  170.23,64.55 180 top
U$201  BAT5406W_COMON_CATHODE_DIODES  [SOT323]  166.5,70.4 0 bottom
U$202  BAT5406W_COMON_CATHODE_DIODES  [SOT323]  169.3,66.3 0 bottom
U$203  YJL2304A_NMOSFET  [SOT23@1]  177.3,71.1 270 bottom
U$204  YJL2304A_NMOSFET  [SOT23@1]  177,64.7 270 bottom
U$205  TC5050RGB_LED  [BIG_SMD_LED]  180.9,72.8 180 top
U$206  TC5050RGB_LED  [BIG_SMD_LED]  181,64.6 180 top
U$207  YJL2304A_NMOSFET  [SOT23@1]  180.2,62.8 90 bottom
U$208  YJL2304A_NMOSFET  [SOT23@1]  171.4,74.8 0 bottom
U$209  YJL2301D_PMOSFET  [SOT23]  183.9,63 180 bottom
U$210  YJL2301D_PMOSFET  [SOT23]  168.8,72.8 90 bottom
U$211  74HC02PW_QUAD_NOR  [TSSOP14]  181.2,85.5 180 bottom
U$212  BAT54SW_SERIES_DIODES  [SOT323]  171.9,82.6 270 bottom
U$213  BAT54SW_SERIES_DIODES  [SOT323]  171.2,87.4 90 bottom
U$214  SMD_MOCROSWITCH  [SMD_MICROSWITCH]  170.23,80.95 180 top
U$215  BAT5406W_COMON_CATHODE_DIODES  [SOT323]  169.3,82.7 0 bottom
U$216  YJL2304A_NMOSFET  [SOT23@1]  177,81.1 270 bottom
U$217  TC5050RGB_LED  [BIG_SMD_LED]  181,81 180 top
U$218  YJL2304A_NMOSFET  [SOT23@1]  180.2,79.2 90 bottom
U$219  YJL2301D_PMOSFET  [SOT23]  183.9,79.4 180 bottom
U$220  SMD_MOCROSWITCH  [SMD_MICROSWITCH]  181.03,7.27 0 top
U$221  YJL2304A_NMOSFET  [SOT23@1]  196.9,58.4 0 bottom
U$222  YJL2301D_PMOSFET  [SOT23]  209.4,46.6 180 bottom
U$223  YJL2301D_PMOSFET  [SOT23]  194.3,56.4 90 bottom
U$224  74HC02PW_QUAD_NOR  [TSSOP14]  206.7,69.1 180 bottom
U$225  BAT54SW_SERIES_DIODES  [SOT323]  197.4,66.2 270 bottom
U$226  BAT54SW_SERIES_DIODES  [SOT323]  196.7,71 90 bottom
U$227  SMD_MOCROSWITCH  [SMD_MICROSWITCH]  195.73,72.64 180 top
U$228  SMD_MOCROSWITCH  [SMD_MICROSWITCH]  195.73,64.55 180 top
U$229  BAT5406W_COMON_CATHODE_DIODES  [SOT323]  192,70.4 0 bottom
U$230  BAT5406W_COMON_CATHODE_DIODES  [SOT323]  194.8,66.3 0 bottom
U$231  YJL2304A_NMOSFET  [SOT23@1]  202.8,71.1 270 bottom
U$232  YJL2304A_NMOSFET  [SOT23@1]  202.5,64.7 270 bottom
U$233  TC5050RGB_LED  [BIG_SMD_LED]  206.4,72.8 180 top
U$234  TC5050RGB_LED  [BIG_SMD_LED]  206.5,64.6 180 top
U$235  YJL2304A_NMOSFET  [SOT23@1]  205.7,62.8 90 bottom
U$236  YJL2304A_NMOSFET  [SOT23@1]  196.9,74.8 0 bottom
U$237  YJL2301D_PMOSFET  [SOT23]  209.4,63 180 bottom
U$238  YJL2301D_PMOSFET  [SOT23]  194.3,72.8 90 bottom
U$239  74HC02PW_QUAD_NOR  [TSSOP14]  206.7,85.5 180 bottom
U$240  BAT54SW_SERIES_DIODES  [SOT323]  197.4,82.6 270 bottom
U$241  BAT54SW_SERIES_DIODES  [SOT323]  196.7,87.4 90 bottom
U$242  SMD_MOCROSWITCH  [SMD_MICROSWITCH]  195.73,80.95 180 top
U$243  BAT5406W_COMON_CATHODE_DIODES  [SOT323]  194.8,82.7 0 bottom
U$244  YJL2304A_NMOSFET  [SOT23@1]  202.5,81.1 270 bottom
U$245  TC5050RGB_LED  [BIG_SMD_LED]  206.5,81 180 top
U$246  YJL2304A_NMOSFET  [SOT23@1]  205.7,79.2 90 bottom
U$247  YJL2301D_PMOSFET  [SOT23]  209.4,79.4 180 bottom
U$248  SMD_MOCROSWITCH  [SMD_MICROSWITCH]  206.53,7.27 0 top
U$249  74HC02PW_QUAD_NOR  [TSSOP14]  232.2,20.1 180 bottom
U$250  BAT54SW_SERIES_DIODES  [SOT323]  222.9,17.2 270 bottom
U$251  BAT54SW_SERIES_DIODES  [SOT323]  222.2,22 90 bottom
U$252  SMD_MOCROSWITCH  [SMD_MICROSWITCH]  221.23,23.64 180 top
U$253  SMD_MOCROSWITCH  [SMD_MICROSWITCH]  221.23,15.55 180 top
U$254  BAT5406W_COMON_CATHODE_DIODES  [SOT323]  217.5,21.4 0 bottom
U$255  BAT5406W_COMON_CATHODE_DIODES  [SOT323]  220.3,17.3 0 bottom
U$256  YJL2304A_NMOSFET  [SOT23@1]  228.3,22.1 270 bottom
U$257  YJL2304A_NMOSFET  [SOT23@1]  228,15.7 270 bottom
U$258  TC5050RGB_LED  [BIG_SMD_LED]  231.9,23.8 180 top
U$259  TC5050RGB_LED  [BIG_SMD_LED]  232,15.6 180 top
U$260  YJL2304A_NMOSFET  [SOT23@1]  222.4,25.8 0 bottom
U$261  YJL2301D_PMOSFET  [SOT23]  219.8,23.8 90 bottom
U$262  74HC02PW_QUAD_NOR  [TSSOP14]  232.2,36.3 180 bottom
U$263  BAT54SW_SERIES_DIODES  [SOT323]  222.9,33.4 270 bottom
U$264  BAT54SW_SERIES_DIODES  [SOT323]  222.2,38.2 90 bottom
U$265  SMD_MOCROSWITCH  [SMD_MICROSWITCH]  221.23,39.84 180 top
U$266  SMD_MOCROSWITCH  [SMD_MICROSWITCH]  221.23,31.75 180 top
U$267  BAT5406W_COMON_CATHODE_DIODES  [SOT323]  217.5,37.6 0 bottom
U$268  BAT5406W_COMON_CATHODE_DIODES  [SOT323]  220.3,33.5 0 bottom
U$269  YJL2304A_NMOSFET  [SOT23@1]  228.3,38.3 270 bottom
U$270  YJL2304A_NMOSFET  [SOT23@1]  228,31.9 270 bottom
U$271  TC5050RGB_LED  [BIG_SMD_LED]  231.9,40 180 top
U$272  TC5050RGB_LED  [BIG_SMD_LED]  232,31.8 180 top
U$273  YJL2304A_NMOSFET  [SOT23@1]  231.2,30 90 bottom
U$274  YJL2304A_NMOSFET  [SOT23@1]  222.4,42 0 bottom
U$275  YJL2301D_PMOSFET  [SOT23]  234.9,30.2 180 bottom
U$276  YJL2301D_PMOSFET  [SOT23]  219.8,40 90 bottom
U$277  74HC02PW_QUAD_NOR  [TSSOP14]  232.2,52.7 180 bottom
U$278  BAT54SW_SERIES_DIODES  [SOT323]  222.9,49.8 270 bottom
U$279  BAT54SW_SERIES_DIODES  [SOT323]  222.2,54.6 90 bottom
U$280  SMD_MOCROSWITCH  [SMD_MICROSWITCH]  221.23,56.24 180 top
U$281  SMD_MOCROSWITCH  [SMD_MICROSWITCH]  221.23,48.15 180 top
U$282  BAT5406W_COMON_CATHODE_DIODES  [SOT323]  217.5,54 0 bottom
U$283  BAT5406W_COMON_CATHODE_DIODES  [SOT323]  220.3,49.9 0 bottom
U$284  YJL2304A_NMOSFET  [SOT23@1]  228.3,54.7 270 bottom
U$285  YJL2304A_NMOSFET  [SOT23@1]  228,48.3 270 bottom
U$286  TC5050RGB_LED  [BIG_SMD_LED]  231.9,56.4 180 top
U$287  TC5050RGB_LED  [BIG_SMD_LED]  232,48.2 180 top
U$288  YJL2304A_NMOSFET  [SOT23@1]  231.2,46.4 90 bottom
U$289  YJL2304A_NMOSFET  [SOT23@1]  222.4,58.4 0 bottom
U$290  YJL2301D_PMOSFET  [SOT23]  234.9,46.6 180 bottom
U$291  YJL2301D_PMOSFET  [SOT23]  219.8,56.4 90 bottom
U$292  74HC02PW_QUAD_NOR  [TSSOP14]  232.2,69.1 180 bottom
U$293  BAT54SW_SERIES_DIODES  [SOT323]  222.9,66.2 270 bottom
U$294  BAT54SW_SERIES_DIODES  [SOT323]  222.2,71 90 bottom
U$295  SMD_MOCROSWITCH  [SMD_MICROSWITCH]  221.23,72.64 180 top
U$296  SMD_MOCROSWITCH  [SMD_MICROSWITCH]  221.23,64.55 180 top
U$297  BAT5406W_COMON_CATHODE_DIODES  [SOT323]  217.5,70.4 0 bottom
U$298  BAT5406W_COMON_CATHODE_DIODES  [SOT323]  220.3,66.3 0 bottom
U$299  YJL2304A_NMOSFET  [SOT23@1]  228.3,71.1 270 bottom
U$300  YJL2304A_NMOSFET  [SOT23@1]  228,64.7 270 bottom
U$301  TC5050RGB_LED  [BIG_SMD_LED]  231.9,72.8 180 top
U$302  TC5050RGB_LED  [BIG_SMD_LED]  232,64.6 180 top
U$303  YJL2304A_NMOSFET  [SOT23@1]  231.2,62.8 90 bottom
U$304  YJL2304A_NMOSFET  [SOT23@1]  222.4,74.8 0 bottom
U$305  YJL2301D_PMOSFET  [SOT23]  234.9,63 180 bottom
U$306  YJL2301D_PMOSFET  [SOT23]  219.8,72.8 90 bottom
U$307  74HC02PW_QUAD_NOR  [TSSOP14]  232.2,85.5 180 bottom
U$308  BAT54SW_SERIES_DIODES  [SOT323]  222.9,82.6 270 bottom
U$309  BAT54SW_SERIES_DIODES  [SOT323]  222.2,87.4 90 bottom
U$310  SMD_MOCROSWITCH  [SMD_MICROSWITCH]  221.23,80.95 180 top
U$311  BAT5406W_COMON_CATHODE_DIODES  [SOT323]  220.3,82.7 0 bottom
U$312  YJL2304A_NMOSFET  [SOT23@1]  228,81.1 270 bottom
U$313  TC5050RGB_LED  [BIG_SMD_LED]  232,81 180 top
U$314  YJL2304A_NMOSFET  [SOT23@1]  231.2,79.2 90 bottom
U$315  YJL2301D_PMOSFET  [SOT23]  234.9,79.4 180 bottom
U$316  SMD_MOCROSWITCH  [SMD_MICROSWITCH]  232.03,7.27 0 top
U$317  BISTABLESWITCH  [BISTABLE_SWITCH]  64.4,76.4 180 top
U$318  TC5050RGB_LED  [BIG_SMD_LED]  64.3,54.2 90 top
U$319  BISTABLESWITCH  [BISTABLE_SWITCH]  64.4,84.3 180 top
U$320  TC5050RGB_LED  [BIG_SMD_LED]  64.3,62.4 270 top
U$321  BISTABLESWITCH  [BISTABLE_SWITCH]  72.5,76.4 180 top
U$322  TC5050RGB_LED  [BIG_SMD_LED]  72.4,54.2 90 top
U$323  BISTABLESWITCH  [BISTABLE_SWITCH]  72.5,84.3 180 top
U$324  TC5050RGB_LED  [BIG_SMD_LED]  72.4,62.4 270 top
U$325  BISTABLESWITCH  [BISTABLE_SWITCH]  80.4,76.4 180 top
U$326  TC5050RGB_LED  [BIG_SMD_LED]  80.3,54.2 90 top
U$327  BISTABLESWITCH  [BISTABLE_SWITCH]  80.4,84.3 180 top
U$328  TC5050RGB_LED  [BIG_SMD_LED]  80.3,62.4 270 top
U$331  YJL2301D_PMOSFET  [SOT23]  119.1,80 270 bottom
U$332  BAT54SW_SERIES_DIODES  [SOT323]  132,79.6 270 bottom
U$335  YJL2301D_PMOSFET  [SOT23]  119.1,70 270 bottom
U$336  BAT54SW_SERIES_DIODES  [SOT323]  132,69.6 270 bottom
U$339  YJL2301D_PMOSFET  [SOT23]  119.1,60 270 bottom
U$340  BAT54SW_SERIES_DIODES  [SOT323]  132,59.6 270 bottom

## Tracks (layer width: path | path; a pad name or v marks a point on that pad's centre or on a via)
CARRY_RESET_IN2  (via drill 0.6 pad 0.9)
  Top 0.2: v174.45,19.65 173.9,20.2 172.1,20.2 171.7,20.6 170.8,20.6 170.2,20 170.2,13.2 171.46,11.94 175.06,11.94 v175.1,11.9 175.8,11.2 178.2,11.2 179.1,10.3 179.1,7.09 U$220.3
  Bottom 0.2: U$150.1WIDEL 172.7,17.9 v174.45,19.65 175.2,20.4 181.3,20.4 183.15,18.55 U$148.8 184.3,18.05 R198.1
CARRY_RESET_IN3  (via drill 0.6 pad 0.9)
  Top 0.2: v199.95,19.65 199.4,20.2 197.6,20.2 197.2,20.6 196.3,20.6 195.7,20 195.7,13.2 196.96,11.94 200.56,11.94 v200.6,11.9 201.3,11.2 203.7,11.2 204.6,10.3 204.6,7.09 U$248.3
  Bottom 0.2: U$5.1WIDEL 198.2,17.9 v199.95,19.65 200.7,20.4 206.8,20.4 208.65,18.55 U$4.8 209.8,18.05 R11.1
CARRY_RESET_IN4  (via drill 0.6 pad 0.9)
  Top 0.2: v225.45,19.65 224.9,20.2 223.1,20.2 222.7,20.6 221.8,20.6 221.2,20 221.2,13.2 222.46,11.94 226.06,11.94 v226.1,11.9 226.8,11.2 229.2,11.2 230.1,10.3 230.1,7.09 U$316.3
  Bottom 0.2: U$250.1WIDEL 223.7,17.9 v225.45,19.65 226.2,20.4 232.3,20.4 234.15,18.55 U$249.8 235.3,18.05 R264.1
CARRY_RESET_OUT2  (via drill 0.6 pad 0.9)
  Top 0.2: v174.45,35.85 173.9,36.4 172.1,36.4 171.7,36.8 170.8,36.8 170.2,36.2 170.2,29.4 171.46,28.14 175.06,28.14 v175.1,28.1
  Bottom 0.2: U$167.1WIDEL 172.7,34.1 v174.45,35.85 175.2,36.6 181.3,36.6 183.15,34.75 U$166.8 184.3,34.25 R211.1 | U$164.SINGLE1 172.69,28.1 v175.1,28.1
CARRY_RESET_OUT4  (via drill 0.6 pad 0.9)
  Top 0.2: v174.45,52.25 173.9,52.8 172.1,52.8 171.7,53.2 170.8,53.2 170.2,52.6 170.2,45.8 171.46,44.54 175.06,44.54 v175.1,44.5
  Bottom 0.2: U$182.1WIDEL 172.7,50.5 v174.45,52.25 175.2,53 181.3,53 183.15,51.15 U$181.8 184.3,50.65 R225.1 | U$178.SINGLE1 173.61,43.01 v175.1,44.5
CARRY_RESET_OUT6  (via drill 0.6 pad 0.9)
  Top 0.2: v174.45,68.65 173.9,69.2 172.1,69.2 171.7,69.6 170.8,69.6 170.2,69 170.2,62.2 171.46,60.94 175.06,60.94 v175.1,60.9
  Bottom 0.2: U$197.1WIDEL 172.7,66.9 v174.45,68.65 175.2,69.4 181.3,69.4 183.15,67.55 U$196.8 184.3,67.05 R239.1 | U$193.SINGLE1 173.61,59.41 v175.1,60.9
CARRY_RESET_OUT8  (via drill 0.6 pad 0.9)
  Top 0.2: v174.45,85.05 173.9,85.6 172.1,85.6 171.7,86 170.8,86 170.2,85.4 170.2,78.6 171.46,77.34 175.06,77.34 v175.1,77.3
  Bottom 0.2: U$212.1WIDEL 172.7,83.3 v174.45,85.05 175.2,85.8 181.3,85.8 183.15,83.95 U$211.8 184.3,83.45 R249.1 | U$208.SINGLE1 173.61,75.81 v175.1,77.3
CARRY_RESET_OUT9  (via drill 0.6 pad 0.9)
  Top 0.2: v199.95,35.85 199.4,36.4 197.6,36.4 197.2,36.8 196.3,36.8 195.7,36.2 195.7,29.4 196.96,28.14 200.56,28.14 v200.6,28.1
  Bottom 0.2: U$57.1WIDEL 198.2,34.1 v199.95,35.85 200.7,36.6 206.8,36.6 208.65,34.75 U$36.8 209.8,34.25 R69.1 | U$34.SINGLE1 198.19,28.1 v200.6,28.1
CARRY_RESET_OUT10  (via drill 0.6 pad 0.9)
  Top 0.2: v199.95,52.25 199.4,52.8 197.6,52.8 197.2,53.2 196.3,53.2 195.7,52.6 195.7,45.8 196.96,44.54 200.56,44.54 v200.6,44.5
  Bottom 0.2: U$100.1WIDEL 198.2,50.5 v199.95,52.25 200.7,53 206.8,53 208.65,51.15 U$99.8 209.8,50.65 R120.1 | U$75.SINGLE1 199.11,43.01 v200.6,44.5
CARRY_RESET_OUT11  (via drill 0.6 pad 0.9)
  Top 0.2: v199.95,68.65 199.4,69.2 197.6,69.2 197.2,69.6 196.3,69.6 195.7,69 195.7,62.2 196.96,60.94 200.56,60.94 v200.6,60.9
  Bottom 0.2: U$225.1WIDEL 198.2,66.9 v199.95,68.65 200.7,69.4 206.8,69.4 208.65,67.55 U$224.8 209.8,67.05 R161.1 | U$221.SINGLE1 199.11,59.41 v200.6,60.9
CARRY_RESET_OUT12  (via drill 0.6 pad 0.9)
  Top 0.2: v199.95,85.05 199.4,85.6 197.6,85.6 197.2,86 196.3,86 195.7,85.4 195.7,78.6 196.96,77.34 200.56,77.34 v200.6,77.3
  Bottom 0.2: U$240.1WIDEL 198.2,83.3 v199.95,85.05 200.7,85.8 206.8,85.8 208.65,83.95 U$239.8 209.8,83.45 R177.1 | U$236.SINGLE1 199.11,75.81 v200.6,77.3
CARRY_RESET_OUT13  (via drill 0.6 pad 0.9)
  Top 0.2: v225.45,35.85 224.9,36.4 223.1,36.4 222.7,36.8 221.8,36.8 221.2,36.2 221.2,29.4 222.46,28.14 226.06,28.14 v226.1,28.1
  Bottom 0.2: U$263.1WIDEL 223.7,34.1 v225.45,35.85 226.2,36.6 232.3,36.6 234.15,34.75 U$262.8 235.3,34.25 R277.1 | U$260.SINGLE1 223.69,28.1 v226.1,28.1
CARRY_RESET_OUT14  (via drill 0.6 pad 0.9)
  Top 0.2: v225.45,52.25 224.9,52.8 223.1,52.8 222.7,53.2 221.8,53.2 221.2,52.6 221.2,45.8 222.46,44.54 226.06,44.54 v226.1,44.5
  Bottom 0.2: U$278.1WIDEL 223.7,50.5 v225.45,52.25 226.2,53 232.3,53 234.15,51.15 U$277.8 235.3,50.65 R291.1 | U$274.SINGLE1 224.61,43.01 v226.1,44.5
CARRY_RESET_OUT15  (via drill 0.6 pad 0.9)
  Top 0.2: v225.45,68.65 224.9,69.2 223.1,69.2 222.7,69.6 221.8,69.6 221.2,69 221.2,62.2 222.46,60.94 226.06,60.94 v226.1,60.9
  Bottom 0.2: U$293.1WIDEL 223.7,66.9 v225.45,68.65 226.2,69.4 232.3,69.4 234.15,67.55 U$292.8 235.3,67.05 R305.1 | U$289.SINGLE1 224.61,59.41 v226.1,60.9
CARRY_RESET_OUT16  (via drill 0.6 pad 0.9)
  Top 0.2: v225.45,85.05 224.9,85.6 223.1,85.6 222.7,86 221.8,86 221.2,85.4 221.2,78.6 222.46,77.34 226.06,77.34 v226.1,77.3
  Bottom 0.2: U$308.1WIDEL 223.7,83.3 v225.45,85.05 226.2,85.8 232.3,85.8 234.15,83.95 U$307.8 235.3,83.45 R315.1 | U$304.SINGLE1 224.61,75.81 v226.1,77.3
CARRY_SET_IN1
  Bottom 0.2: 170.4,86.85 171.25,87.7 171.25,88.25 171.4,88.4 171.8,88.4 173.6,90.2 174.3,90.2 174.5,90.4 181.7,90.4 182.1,90 R250.1
  Bottom 0.305: U$211.6 R250.1
CARRY_SET_IN2
  Bottom 0.2: 195.9,86.85 196.75,87.7 196.75,88.25 196.9,88.4 197.3,88.4 199.1,90.2 199.8,90.2 200,90.4 207.2,90.4 207.6,90 R253.1
  Bottom 0.305: U$239.6 R253.1
CARRY_SET_IN3
  Bottom 0.2: 221.4,86.85 222.25,87.7 222.25,88.25 222.4,88.4 222.8,88.4 224.6,90.2 225.3,90.2 225.5,90.4 232.7,90.4 233.1,90 R316.1
  Bottom 0.305: U$307.6 R316.1
CARRY_SET_OUT1
  Bottom 0.2: 170.35,21.4 U$153.1WIDEL | U$153.1WIDEL 170.4,21.45 171.25,22.3 171.25,22.85 171.4,23 171.8,23 173.6,24.8 174.3,24.8 174.5,25 181.7,25 182.1,24.6 R199.1 183.5,24.6 183.9,25 U$179.SINGLE1 | U$153.1WIDEL 170.25,21.35 167.8,18.9 166.43,18.9 165.85,19.48 U$158.2WIDER
  Bottom 0.305: U$148.6 R199.1
CARRY_SET_OUT2
  Bottom 0.2: 170.35,37.6 U$168.1WIDEL | U$168.1WIDEL 170.4,37.65 171.25,38.5 171.25,39.05 171.4,39.2 171.8,39.2 173.6,41 174.3,41 174.5,41.2 181.3,41.2 181.7,41.2 182.1,40.8 R212.1 183.5,40.8 183.9,41.2 U$194.SINGLE1 | U$168.1WIDEL 170.25,37.55 167.8,35.1 166.43,35.1 165.85,35.68 U$171.2WIDER
  Bottom 0.305: U$166.6 R212.1
CARRY_SET_OUT4
  Bottom 0.2: 170.35,54 U$183.1WIDEL | U$183.1WIDEL 170.4,54.05 171.25,54.9 171.25,55.45 171.4,55.6 171.8,55.6 173.6,57.4 174.3,57.4 174.5,57.6 181.7,57.6 182.1,57.2 R226.1 183.3,57.2 183.9,57.8 U$209.SINGLE1 | U$183.1WIDEL 170.25,53.95 167.8,51.5 166.43,51.5 165.85,52.08 U$186.2WIDER
  Bottom 0.305: U$181.6 R226.1
CARRY_SET_OUT6
  Bottom 0.2: 170.35,70.4 U$198.1WIDEL | U$198.1WIDEL 170.4,70.45 171.25,71.3 171.25,71.85 171.4,72 171.8,72 173.6,73.8 174.3,73.8 174.5,74 181.7,74 182.1,73.6 R240.1 183.1,73.6 183.9,74.4 U$219.SINGLE1 | U$198.1WIDEL 170.25,70.35 167.8,67.9 166.43,67.9 165.85,68.48 U$201.2WIDER
  Bottom 0.305: U$196.6 R240.1
CARRY_SET_OUT8
  Bottom 0.2: 195.85,21.4 U$6.1WIDEL | U$6.1WIDEL 195.9,21.45 196.75,22.3 196.75,22.85 196.9,23 197.3,23 199.1,24.8 199.8,24.8 200,25 207.2,25 207.6,24.6 R12.1 209,24.6 209.4,25 U$97.SINGLE1 | U$6.1WIDEL 195.75,21.35 193.3,18.9 191.93,18.9 191.35,19.48 U$9.2WIDER
  Bottom 0.305: U$4.6 R12.1
CARRY_SET_OUT10
  Bottom 0.2: 195.85,37.6 U$59.1WIDEL | U$59.1WIDEL 195.9,37.65 196.75,38.5 196.75,39.05 196.9,39.2 197.3,39.2 199.1,41 199.8,41 200,41.2 206.8,41.2 207.2,41.2 207.6,40.8 R70.1 209,40.8 209.4,41.2 U$222.SINGLE1 | U$59.1WIDEL 195.75,37.55 193.3,35.1 191.93,35.1 191.35,35.68 U$62.2WIDER
  Bottom 0.305: U$36.6 R70.1
CARRY_SET_OUT11
  Bottom 0.2: 195.85,54 U$101.1WIDEL | U$101.1WIDEL 195.9,54.05 196.75,54.9 196.75,55.45 196.9,55.6 197.3,55.6 199.1,57.4 199.8,57.4 200,57.6 207.2,57.6 207.6,57.2 R121.1 208.8,57.2 209.4,57.8 U$237.SINGLE1 | U$101.1WIDEL 195.75,53.95 193.3,51.5 191.93,51.5 191.35,52.08 U$125.2WIDER
  Bottom 0.305: U$99.6 R121.1
CARRY_SET_OUT12
  Bottom 0.2: 195.85,70.4 U$226.1WIDEL | U$226.1WIDEL 195.9,70.45 196.75,71.3 196.75,71.85 196.9,72 197.3,72 199.1,73.8 199.8,73.8 200,74 207.2,74 207.6,73.6 R162.1 208.6,73.6 209.4,74.4 U$247.SINGLE1 | U$226.1WIDEL 195.75,70.35 193.3,67.9 191.93,67.9 191.35,68.48 U$229.2WIDER
  Bottom 0.305: U$224.6 R162.1
CARRY_SET_OUT13
  Bottom 0.2: 221.35,21.4 U$251.1WIDEL | U$251.1WIDEL 221.4,21.45 222.25,22.3 222.25,22.85 222.4,23 222.8,23 224.6,24.8 225.3,24.8 225.5,25 232.7,25 233.1,24.6 R265.1 234.5,24.6 234.9,25 U$275.SINGLE1 | U$251.1WIDEL 221.25,21.35 218.8,18.9 217.43,18.9 216.85,19.48 U$254.2WIDER
  Bottom 0.305: U$249.6 R265.1
CARRY_SET_OUT14
  Bottom 0.2: 221.35,37.6 U$264.1WIDEL | U$264.1WIDEL 221.4,37.65 222.25,38.5 222.25,39.05 222.4,39.2 222.8,39.2 224.6,41 225.3,41 225.5,41.2 232.3,41.2 232.7,41.2 233.1,40.8 R278.1 234.5,40.8 234.9,41.2 U$290.SINGLE1 | U$264.1WIDEL 221.25,37.55 218.8,35.1 217.43,35.1 216.85,35.68 U$267.2WIDER
  Bottom 0.305: U$262.6 R278.1
CARRY_SET_OUT15
  Bottom 0.2: 221.35,54 U$279.1WIDEL | U$279.1WIDEL 221.4,54.05 222.25,54.9 222.25,55.45 222.4,55.6 222.8,55.6 224.6,57.4 225.3,57.4 225.5,57.6 232.7,57.6 233.1,57.2 R292.1 234.3,57.2 234.9,57.8 U$305.SINGLE1 | U$279.1WIDEL 221.25,53.95 218.8,51.5 217.43,51.5 216.85,52.08 U$282.2WIDER
  Bottom 0.305: U$277.6 R292.1
CARRY_SET_OUT16
  Bottom 0.2: 221.35,70.4 U$294.1WIDEL | U$294.1WIDEL 221.4,70.45 222.25,71.3 222.25,71.85 222.4,72 222.8,72 224.6,73.8 225.3,73.8 225.5,74 232.7,74 233.1,73.6 R306.1 234.1,73.6 234.9,74.4 U$315.SINGLE1 | U$294.1WIDEL 221.25,70.35 218.8,67.9 217.43,67.9 216.85,68.48 U$297.2WIDER
  Bottom 0.305: U$292.6 R306.1
ENB2
  Bottom 0.2: U$148.5 181.85,22.45 181.6,22.2 179.7,22.2 179.25,22.65 U$148.1 178.56,23.3 U$160.WIDEL
ENB4
  Bottom 0.2: U$166.5 181.85,38.65 181.6,38.4 179.7,38.4 179.25,38.85 U$166.1 178.56,39.5 U$173.WIDEL
ENB6
  Bottom 0.2: U$181.5 181.85,55.05 181.6,54.8 179.7,54.8 179.25,55.25 U$181.1 178.56,55.9 U$188.WIDEL
ENB8
  Bottom 0.2: U$196.5 181.85,71.45 181.6,71.2 179.7,71.2 179.25,71.65 U$196.1 178.56,72.3 U$203.WIDEL
ENB10
  Bottom 0.2: U$211.1 179.25,88.05 179.7,87.6 181.6,87.6 181.85,87.85 U$211.5
ENB11
  Bottom 0.2: U$4.5 207.35,22.45 207.1,22.2 205.2,22.2 204.75,22.65 U$4.1 204.06,23.3 U$20.WIDEL
ENB12
  Bottom 0.2: U$36.5 207.35,38.65 207.1,38.4 205.2,38.4 204.75,38.85 U$36.1 204.06,39.5 U$70.WIDEL
ENB13
  Bottom 0.2: U$99.5 207.35,55.05 207.1,54.8 205.2,54.8 204.75,55.25 U$99.1 204.06,55.9 U$127.WIDEL
ENB14
  Bottom 0.2: U$224.5 207.35,71.45 207.1,71.2 205.2,71.2 204.75,71.65 U$224.1 204.06,72.3 U$231.WIDEL
ENB15
  Bottom 0.2: U$239.1 204.75,88.05 205.2,87.6 207.1,87.6 207.35,87.85 U$239.5
ENB16
  Bottom 0.2: U$249.5 232.85,22.45 232.6,22.2 230.7,22.2 230.25,22.65 U$249.1 229.56,23.3 U$256.WIDEL
ENB17
  Bottom 0.2: U$262.5 232.85,38.65 232.6,38.4 230.7,38.4 230.25,38.85 U$262.1 229.56,39.5 U$269.WIDEL
ENB18
  Bottom 0.2: U$277.5 232.85,55.05 232.6,54.8 230.7,54.8 230.25,55.25 U$277.1 229.56,55.9 U$284.WIDEL
ENB19
  Bottom 0.2: U$292.5 232.85,71.45 232.6,71.2 230.7,71.2 230.25,71.65 U$292.1 229.56,72.3 U$299.WIDEL
ENB20
  Bottom 0.2: U$307.1 230.25,88.05 230.7,87.6 232.6,87.6 232.85,87.85 U$307.5
GND  (via drill 0.6 pad 0.9)
  Top 0.2: v176.4,26.5 176.4,26.6 | v201.9,26.5 201.9,26.6 | v227.4,26.5 227.4,26.6
  Bottom 0.2: U$161.WIDER 177.76,14.75 | R201.1 166,15.7 v166,15.2 | U$174.WIDER 177.76,30.95 | R214.1 166,31.9 v166,31.4 | U$189.WIDER 177.76,47.35 | R228.1 166,48.3 v166,47.8 | U$204.WIDER 177.76,63.75 | R242.1 166,64.7 v166,64.2 | U$216.WIDER 177.76,80.15 | R215.1 180.9,26.6 180.8,26.5 v176.4,26.5 | R229.1 180.9,43.09 180.61,42.8 v176.5,42.8 | R226.2 179.7,58.2 178.7,59.2 v176.5,59.2 | R240.2 177.3,74.6 v176.3,75.6 | U$31.WIDER 203.26,14.75 | R14.1 191.5,15.7 v191.5,15.2 | U$71.WIDER 203.26,30.95 | R86.1 191.5,31.9 v191.5,31.4 | U$132.WIDER 203.26,47.35 | R123.1 191.5,48.3 v191.5,47.8 | U$232.WIDER 203.26,63.75 | R164.1 191.5,64.7 v191.5,64.2 | U$244.WIDER 203.26,80.15 | R87.1 206.4,26.6 206.3,26.5 v201.9,26.5 | R142.1 206.4,43.09 206.11,42.8 v202,42.8 | R121.2 205.2,58.2 204.2,59.2 v202,59.2 | R162.2 202.8,74.6 v201.8,75.6 | U$257.WIDER 228.76,14.75 | R267.1 217,15.7 v217,15.2 | U$270.WIDER 228.76,30.95 | R280.1 217,31.9 v217,31.4 | U$285.WIDER 228.76,47.35 | R294.1 217,48.3 v217,47.8 | U$300.WIDER 228.76,63.75 | R308.1 217,64.7 v217,64.2 | U$312.WIDER 228.76,80.15 | R281.1 231.9,26.6 231.8,26.5 v227.4,26.5 | R295.1 231.9,43.09 231.61,42.8 v227.5,42.8 | R292.2 230.7,58.2 229.7,59.2 v227.5,59.2 | R306.2 228.3,74.6 v227.3,75.6
  pour Top (isolate 0.254): -10,-10 -10,110 255,110 255,-10
  pour Bottom (isolate 0.254): -5,-5 -5,105 250,105 250,-5
LED+B  (via drill 0.6 pad 0.9)  (3 unrouted)
  Top 0.2: 181.1,46.1 181.1,42.9 | 181.1,61.8 181.1,59.2 | 206.6,46.1 206.6,42.9 | 206.6,61.8 206.6,59.2 | 232.1,46.1 232.1,42.9 | 232.1,61.8 232.1,59.2
  Top 0.406: R21.1 21,10.2 v20,11.2 | R30.1 21,20.3 v20,21.3 | R33.1 21,30.4 v20,31.4 | R36.1 21,40.5 v20,41.5 | R62.1 41,10.2 v40,11.2 | R65.1 41,20.3 v40,21.3 | R68.1 41,30.4 v40,31.4 | R94.1 61,10.2 v60,11.2 | R97.1 61,20.3 v60,21.3 | R114.1 61,30.4 v60,31.4 | R126.1 81,10.2 v80,11.2 | R129.1 81,20.3 v80,21.3 | R141.1 81,30.4 v80,31.4 | R153.1 101,10.2 v100,11.2 | R156.1 101,20.3 v100,21.3 | R159.1 101,30.4 v100,31.4 | R168.1 121,10.2 v120,11.2 | R171.1 121,20.3 v120,21.3 | R180.1 141,10.2 v140,11.2 | R183.1 141,20.3 v140,21.3 | R189.1 145.2,20.6 v144.2,19.6 | R195.1 154.4,20.6 v153.4,19.6 | R186.1 186.1,26.8 185.7,27.2 181.1,27.2 | R192.1 186.2,18.2 185.8,18.6 181.1,18.6 | R204.1 186.1,43 185.7,43.4 181.1,43.4 | R207.1 186.2,34.4 185.8,34.8 181.1,34.8 | R218.1 186.1,59.4 185.7,59.8 181.1,59.8 | R221.1 186.2,50.8 185.8,51.2 181.1,51.2 | R232.1 186.1,75.8 185.7,76.2 181.1,76.2 | R235.1 186.2,67.2 185.8,67.6 181.1,67.6 | R246.1 186.2,83.6 185.8,84 181.1,84 | R5.1 211.6,26.8 211.2,27.2 206.6,27.2 | R8.1 211.7,18.2 211.3,18.6 206.6,18.6 | R39.1 211.6,43 211.2,43.4 206.6,43.4 | R42.1 211.7,34.4 211.3,34.8 206.6,34.8 | R90.1 211.6,59.4 211.2,59.8 206.6,59.8 | R116.1 211.7,50.8 211.3,51.2 206.6,51.2 | R145.1 211.6,75.8 211.2,76.2 206.6,76.2 | R148.1 211.7,67.2 211.3,67.6 206.6,67.6 | R174.1 211.7,83.6 211.3,84 206.6,84 | R258.1 237.1,26.8 236.7,27.2 232.1,27.2 | R261.1 237.2,18.2 236.8,18.6 232.1,18.6 | R270.1 237.1,43 236.7,43.4 232.1,43.4 | R273.1 237.2,34.4 236.8,34.8 232.1,34.8 | R284.1 237.1,59.4 236.7,59.8 232.1,59.8 | R287.1 237.2,50.8 236.8,51.2 232.1,51.2 | R298.1 237.1,75.8 236.7,76.2 232.1,76.2 | R301.1 237.2,67.2 236.8,67.6 232.1,67.6
  Top 0.406: R312.1 237.2,83.6 236.8,84 232.1,84 | R140.1 10.5,49 v11.5,50 | R321.1 4.7,67.6 v3.7,66.6 | R324.1 18.6,49 v19.6,50 | R327.1 12.8,67.6 v11.8,66.6 | R330.1 26.8,49 v27.8,50 | R333.1 21,67.6 v20,66.6 | R336.1 34.9,49 v35.9,50 | R339.1 29.1,67.6 v28.1,66.6 | R342.1 42.8,49 v43.8,50 | R345.1 37,67.6 v36,66.6 | R348.1 50.9,49 v51.9,50 | R351.1 45.1,67.6 v44.1,66.6 | R354.1 59,49 v60,50 | R357.1 53.2,67.6 v52.2,66.6 | R360.1 67.2,49 v68.2,50 | R363.1 61.4,67.6 v60.4,66.6 | R366.1 75.3,49 v76.3,50 | R369.1 69.5,67.6 v68.5,66.6 | R372.1 83.2,49 v84.2,50 | R375.1 77.4,67.6 v76.4,66.6
  Top 1.016: 206.6,9.4 206.6,18.6 206.6,27.2 206.6,34.8 206.6,42.9 206.6,43.4 206.6,46.1 206.6,51.2 206.6,59.2 206.6,59.8 206.6,61.8 206.6,67.6 206.6,76.2 206.6,84 206.6,95.3 | 232.1,9.4 232.1,18.6 232.1,27.2 232.1,34.8 232.1,42.9 232.1,43.4 232.1,46.1 232.1,51.2 232.1,59.2 232.1,59.8 232.1,61.8 232.1,67.6 232.1,76.2 232.1,84 232.1,92.7 229.5,95.3 206.6,95.3 | v181.1,11.8 181.1,18.6 181.1,27.2 181.1,34.8 181.1,42.9 181.1,43.4 181.1,46.1 181.1,51.2 181.1,59.2 181.1,59.8 181.1,61.8 181.1,67.6 181.1,76.2 181.1,84 181.1,93.3 183.1,95.3 206.6,95.3
  Bottom 0.406: v20,11.2 22.4,11.2 | v20,21.3 22.4,21.3 | v20,31.4 22.4,31.4 | v20,41.5 22.4,41.5 | v40,11.2 42.4,11.2 | v40,21.3 42.4,21.3 | v40,31.4 42.4,31.4 | v60,11.2 62.4,11.2 | v60,21.3 62.4,21.3 | v60,31.4 62.4,31.4 | v80,11.2 82.4,11.2 | v80,21.3 82.4,21.3 | v80,31.4 82.4,31.4 | v100,11.2 102.4,11.2 | v100,21.3 102.4,21.3 | v100,31.4 102.4,31.4 | v120,11.2 122.4,11.2 | v120,21.3 122.4,21.3 | v140,11.2 142.4,11.2 | v140,21.3 142.4,21.3 | v144.2,19.6 144.2,22 | v153.4,19.6 153.4,22 | v11.5,50 11.5,47.6 | v3.7,66.6 3.7,71.7 | v19.6,50 19.6,47.6 | v11.8,66.6 11.8,71.7 | v27.8,50 27.8,47.6 | v20,66.6 20,71.7 | v35.9,50 35.9,47.6 | v28.1,66.6 28.1,71.7 | v43.8,50 43.8,47.6 | v51.9,50 51.9,47.6 | v44.1,66.6 44.1,71.7 | v60,50 60,47.6 | v52.2,66.6 52.2,71.7 | v68.2,50 68.2,47.6 | v60.4,66.6 60.4,71.7 | v76.3,50 76.3,47.6 | v68.5,66.6 68.5,71.7 | v84.2,50 84.2,47.6 | v76.4,66.6 76.4,71.7 | v36,66.6 36,71.7
  Bottom 1.016: 22.4,11.2 22.4,21.3 22.4,31.4 22.4,41.5 22.4,47.5 22.5,47.6 | 42.4,11.2 42.4,21.3 42.4,31.4 42.4,47.6 | 62.4,11.2 62.4,21.3 62.4,31.4 62.4,47.6 | 82.4,11.2 82.4,21.3 82.4,31.4 82.4,47.4 82.6,47.6 | 102.4,11.2 102.4,21.3 102.4,24 102.4,31.4 102.4,32.6 87.4,47.6 | 122.4,11.2 122.4,21.3 122.4,22.5 142.4,22.5 | 142.4,22.5 142.4,21.3 142.4,11.2 | 152.5,22 144.2,22 143.7,22.5 142.4,22.5 | 152.2,22 153.4,22 161.7,22 162.5,21.2 162.5,11.8 167.3,7 179,7 181.1,9.1 v181.1,11.8 | 19.6,47.6 11.5,47.6 | 19.5,47.6 22.5,47.6 | 22.5,47.6 27.8,47.6 35.9,47.6 42.4,47.6 | 43.6,47.6 51.9,47.6 60,47.6 62.4,47.6 | 62.4,47.6 68.2,47.6 76.3,47.6 82.6,47.6 | 3.7,71.7 11.8,71.7 20,71.7 28.1,71.7 34.6,71.7 36,71.7 44.1,71.7 52.2,71.7 60.4,71.7 68.5,71.7 76.4,71.7 84.7,71.7 87.4,69 87.4,47.6 | 42.4,47.6 43.8,47.6 | 82.6,47.6 84.2,47.6 87.4,47.6
  Bottom 1.27: 122.4,22.5 120.9,24 102.4,24 | U$339.SINGLE1 118.09,52.11 122.1,48.1 134.6,48.1 142.4,40.3 142.4,22.5
LED+G  (via drill 0.6 pad 0.9)  (23 unrouted)